# Altium schematic sheet Sensing - Position.SchDoc: [10] Sensing - Position
size A4; ApprovedBy: Nagy Richard; CheckedBy: Nagy Richard; Author: Nagy Richard; CompanyName: EmbedCore; DrawnBy: Nagy Richard; Engineer: Nagy Richard; Organization: EmbedCore; DocumentNumber: 10; Revision: 1.0; SheetNumber: 10; SheetTotal: 15
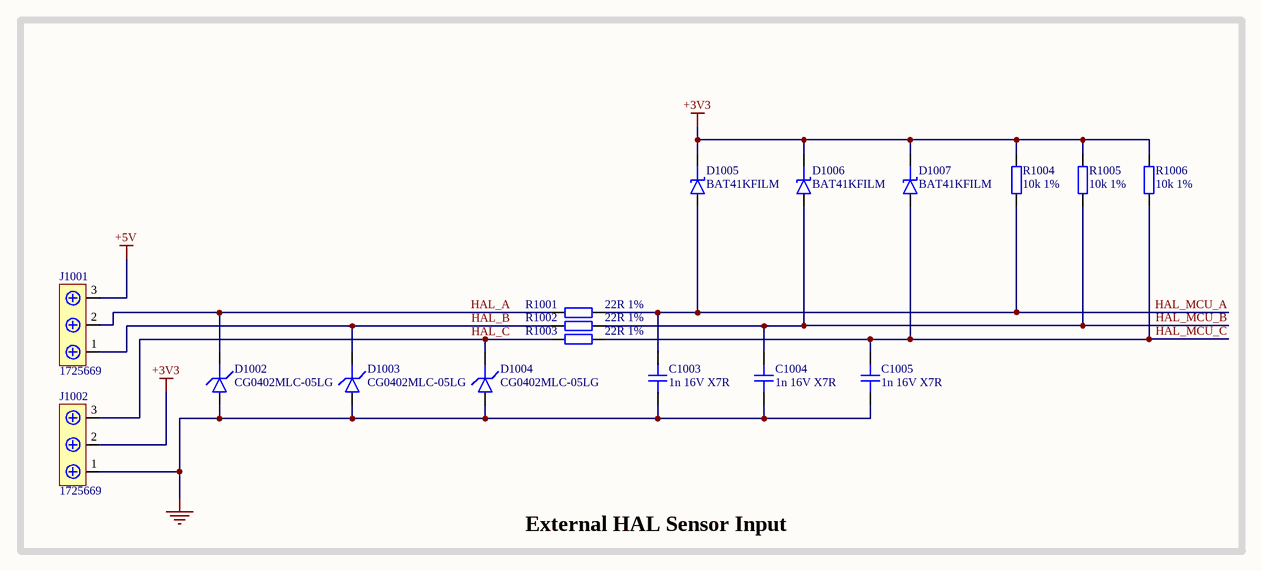
[diagram p0: Sensing - Position.SchDoc]

## Parts
C1003  1n 16V X7R  [CAP_0402]
C1004  1n 16V X7R  [CAP_0402]
C1005  1n 16V X7R  [CAP_0402]
D1002  CG0402MLC-05LG  [D_0402]
D1003  CG0402MLC-05LG  [D_0402]
D1004  CG0402MLC-05LG  [D_0402]
D1005  BAT41KFILM  [SOD-523]
D1006  BAT41KFILM  [SOD-523]
D1007  BAT41KFILM  [SOD-523]
J1001  1725669  [1725669]
J1002  1725669  [1725669]
R1001  22R 1%  [RES_0402]
R1002  22R 1%  [RES_0402]
R1003  22R 1%  [RES_0402]
R1004  10k 1%  [RES_0402]
R1005  10k 1%  [RES_0402]
R1006  10k 1%  [RES_0402]

## Blocks framed on the sheet
External HAL Sensor Input: C1003-C1005 D1002-D1007 J1001 J1002 R1001-R1006

## Nets
+3V3: D1005.K D1006.K D1007.K J1002.2 R1004.2 R1005.2 R1006.2
+5V: J1001.3
GND: C1003.1 C1004.1 C1005.1 D1002.A D1003.A D1004.A J1002.1
HAL_A: D1002.K J1001.2 R1001.2
HAL_B: D1003.K J1001.1 R1002.2
HAL_C: D1004.K J1002.3 R1003.2
HAL_MCU_A: C1003.2 D1005.A R1001.1 R1004.1
HAL_MCU_B: C1004.2 D1006.A R1002.1 R1005.1
HAL_MCU_C: C1005.2 D1007.A R1003.1 R1006.1

## Notes on the sheet
- Title:
- Drawn By:
- Page Contents:
- Checked By:
- Size:
- Date:
- File:
- License:
- Email:
- A4
- Number:
- Time:
- Revision:
- Sheet
- Website:
- of

## Library data of the parts
C1003-C1005 = CAP_0402: Capacitor SMD 0402; Manufacturer: YAGEO; Manufacturer Part Number: CC0402KRX7R7BB102; Distributor Link: www.lcsc.com; LCSC: C189467; Rating: *; Dielectric: *
D1002 = D_TVS_0402: Diode TVS / ESD 0402; Manufacturer: BOURNS; Manufacturer Part Number: CG0402MLC-05LG; LCSC: C711709
D1003 D1004 = D_TVS_0402: Diode TVS / ESD 0402
D1005-D1007 = D_SCHOTTKY_SOD_523: Diode Schottky SMD SOD-323; Manufacturer: STMicroelectronics; Manufacturer Part Number: BAT41KFILM; LCSC: C73150
J1001 J1002 = 1725669: Screw Terminal Block 3 Positions 2.54mm; Manufacturer: Phoenix; Manufacturer Part Number: 1725669; Distributor Link: https://www.mouser.de/ProductDetail/Phoenix-Contact/1725669?qs=A%2FKWGUWTCZjmkTL0Oe91ew%3D%3D
R1001-R1003 = RES_0402: Resistor SMD 0402; Manufacturer: PANASONIC; Manufacturer Part Number: ERJPA2F22R0X; Distributor Link: www.lcsc.com; LCSC: C427230
R1004-R1006 = RES_0402: Resistor SMD 0402; Manufacturer: PANASONIC; Manufacturer Part Number: ERJPA2F1002X; Distributor Link: www.lcsc.com; LCSC: C427247